# Altium schematic sheet PROB_S7CAS_PHY.SchDoc
size Tabloid; SheetNumber: 11; SheetTotal: 15; Sheet_Name: Ethernet Transceiver FPGA; Size: 11x17
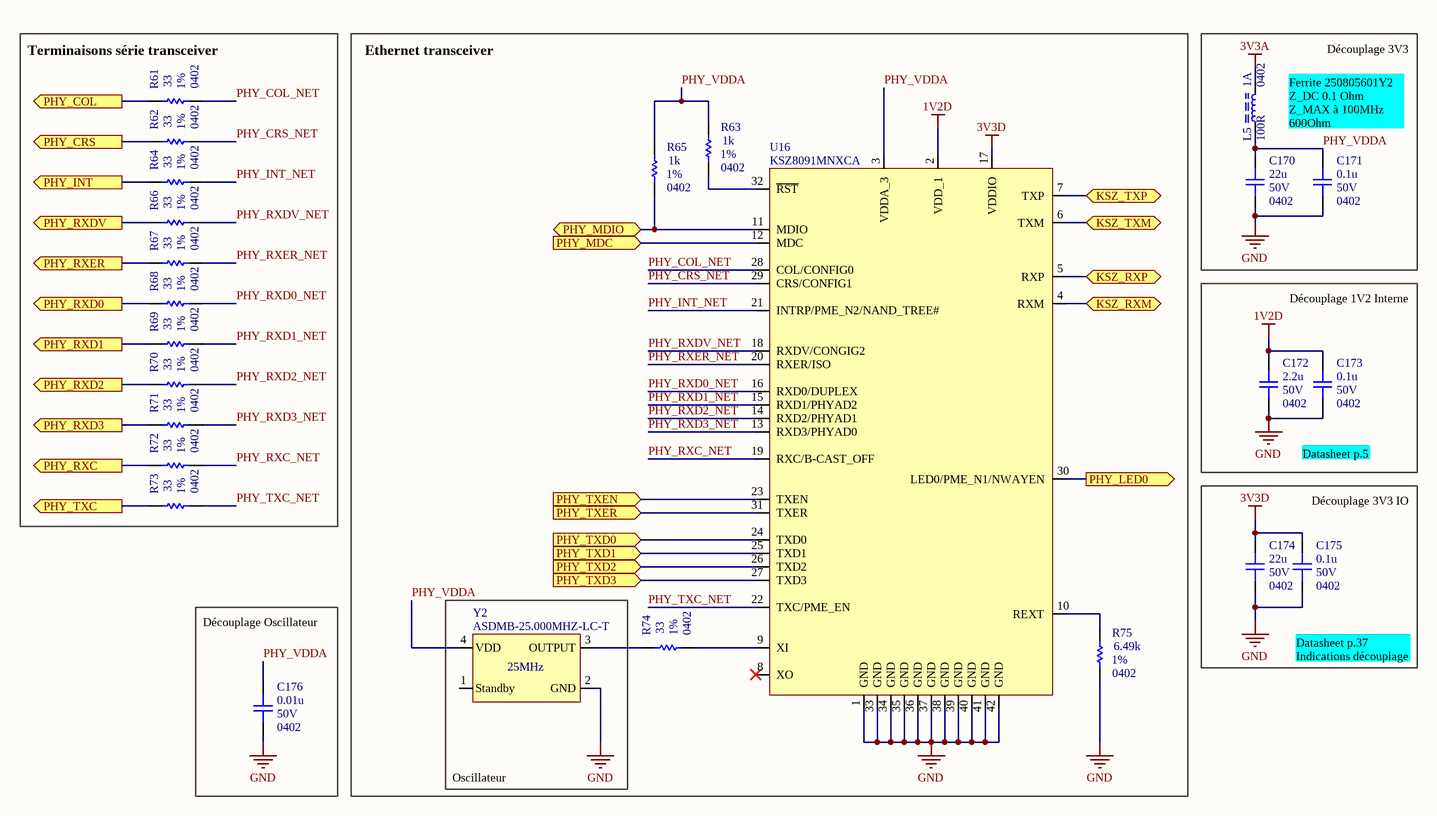
[diagram p0: PROB_S7CAS_PHY.SchDoc]

## Parts
C170  value 22u  Voltage: 50V  Package: 0402  [CAP_0402]  (hidden comment: CAP - 0402)
C171  value 0.1u  Voltage: 50V  Package: 0402  [CAP_0402]  (hidden comment: CAP - 0402)
C172  value 2.2u  Voltage: 50V  Package: 0402  [CAP_0402]  (hidden comment: CAP - 0402)
C173  value 0.1u  Voltage: 50V  Package: 0402  [CAP_0402]  (hidden comment: CAP - 0402)
C174  value 22u  Voltage: 50V  Package: 0402  [CAP_0402]  (hidden comment: CAP - 0402)
C175  value 0.1u  Voltage: 50V  Package: 0402  [CAP_0402]  (hidden comment: CAP - 0402)
C176  value 0.01u  Voltage: 50V  Package: 0402  [CAP_0402]  (hidden comment: CAP - 0402)
L5  value 100R  Current: 1A  Package: 0402  [FER_0402]  (hidden comment: FER - 0402)
R61  value 33  Package: 0402  Precision: 1%  [RES_0402]  (hidden comment: RES - 0402)
R62  value 33  Package: 0402  Precision: 1%  [RES_0402]  (hidden comment: RES - 0402)
R63  value 1k  Package: 0402  Precision: 1%  [RES_0402]  (hidden comment: RES - 0402)
R64  value 33  Package: 0402  Precision: 1%  [RES_0402]  (hidden comment: RES - 0402)
R65  value 1k  Package: 0402  Precision: 1%  [RES_0402]  (hidden comment: RES - 0402)
R66  value 33  Package: 0402  Precision: 1%  [RES_0402]  (hidden comment: RES - 0402)
R67  value 33  Package: 0402  Precision: 1%  [RES_0402]  (hidden comment: RES - 0402)
R68  value 33  Package: 0402  Precision: 1%  [RES_0402]  (hidden comment: RES - 0402)
R69  value 33  Package: 0402  Precision: 1%  [RES_0402]  (hidden comment: RES - 0402)
R70  value 33  Package: 0402  Precision: 1%  [RES_0402]  (hidden comment: RES - 0402)
R71  value 33  Package: 0402  Precision: 1%  [RES_0402]  (hidden comment: RES - 0402)
R72  value 33  Package: 0402  Precision: 1%  [RES_0402]  (hidden comment: RES - 0402)
R73  value 33  Package: 0402  Precision: 1%  [RES_0402]  (hidden comment: RES - 0402)
R74  value 33  Package: 0402  Precision: 1%  [RES_0402]  (hidden comment: RES - 0402)
R75  value 6.49k  Package: 0402  Precision: 1%  [RES_0402]  (hidden comment: RES - 0402)
U16  KSZ8091MNXCA  [COM_ETH_PHY_KSZ8091MNXCA]
Y2  ASDMB-25.000MHZ-LC-T  [OSC_ASDMB-25.000MHZ-LC-T]

## Ports
KSZ_RXM (bidir), KSZ_RXP (bidir), KSZ_TXM (bidir), KSZ_TXP (bidir), PHY_COL (out), PHY_CRS (out), PHY_INT (out), PHY_LED0 (out), PHY_MDC (in), PHY_MDIO (bidir), PHY_RXC (out), PHY_RXD0 (out), PHY_RXD1 (out), PHY_RXD2 (out), PHY_RXD3 (out), PHY_RXDV (out), PHY_RXER (out), PHY_TXC (out), PHY_TXD0 (in), PHY_TXD1 (in), PHY_TXD2 (in), PHY_TXD3 (in), PHY_TXEN (in), PHY_TXER (in)

## Nets
1V2D: C172.2 C173.2 U16.2(VDD_1)
3V3A: L5.1
3V3D: C174.2 C175.2 U16.17(VDDIO)
GND: C170.1 C171.1 C172.1 C173.1 C174.1 C175.1 C176.1 R75.1 U16.1(GND) U16.33(GND) U16.34(GND) U16.35(GND) U16.36(GND) U16.37(GND) U16.38(GND) U16.39(GND) U16.40(GND) U16.41(GND) U16.42(GND) Y2.2(GND)
KSZ_RXM: U16.4(RXM) ; port KSZ_RXM
KSZ_RXP: U16.5(RXP) ; port KSZ_RXP
KSZ_TXM: U16.6(TXM) ; port KSZ_TXM
KSZ_TXP: U16.7(TXP) ; port KSZ_TXP
PHY_COL: R61.2 ; port PHY_COL
PHY_COL_NET: R61.1 U16.28(COL/CONFIG0)
PHY_CRS: R62.2 ; port PHY_CRS
PHY_CRS_NET: R62.1 U16.29(CRS/CONFIG1)
PHY_INT: R64.2 ; port PHY_INT
PHY_INT_NET: R64.1 U16.21(INTRP/PME_N2/NAND_TREE#)
PHY_LED0: U16.30(LED0/PME_N1/NWAYEN) ; port PHY_LED0
PHY_MDC: U16.12(MDC) ; port PHY_MDC
PHY_MDIO: R65.1 U16.11(MDIO) ; port PHY_MDIO
PHY_RXC: R72.2 ; port PHY_RXC
PHY_RXC_NET: R72.1 U16.19(RXC/B-CAST_OFF)
PHY_RXD0: R68.2 ; port PHY_RXD0
PHY_RXD0_NET: R68.1 U16.16(RXD0/DUPLEX)
PHY_RXD1: R69.2 ; port PHY_RXD1
PHY_RXD1_NET: R69.1 U16.15(RXD1/PHYAD2)
PHY_RXD2: R70.2 ; port PHY_RXD2
PHY_RXD2_NET: R70.1 U16.14(RXD2/PHYAD1)
PHY_RXD3: R71.2 ; port PHY_RXD3
PHY_RXD3_NET: R71.1 U16.13(RXD3/PHYAD0)
PHY_RXDV: R66.2 ; port PHY_RXDV
PHY_RXDV_NET: R66.1 U16.18(RXDV/CONGIG2)
PHY_RXER: R67.2 ; port PHY_RXER
PHY_RXER_NET: R67.1 U16.20(RXER/ISO)
PHY_TXC: R73.2 ; port PHY_TXC
PHY_TXC_NET: R73.1 U16.22(TXC/PME_EN)
PHY_TXD0: U16.24(TXD0) ; port PHY_TXD0
PHY_TXD1: U16.25(TXD1) ; port PHY_TXD1
PHY_TXD2: U16.26(TXD2) ; port PHY_TXD2
PHY_TXD3: U16.27(TXD3) ; port PHY_TXD3
PHY_TXEN: U16.23(TXEN) ; port PHY_TXEN
PHY_TXER: U16.31(TXER) ; port PHY_TXER
PHY_VDDA: C170.2 C171.2 C176.2 L5.2 R63.2 R65.2 U16.3(VDDA_3) Y2.4(VDD)
NetR63_1: R63.1 U16.32(~{RST})
NetR74_1: R74.1 U16.9(XI)
NetR74_2: R74.2 Y2.3(OUTPUT)
NetR75_2: R75.2 U16.10(REXT)

Not connected (* = marked no-connect by the designer): U16 8(XO)*; Y2 1(Standby)

## Notes on the sheet
- (near R61) Terminaisons série transceiver
- Ethernet transceiver
- (near L5) Découplage 3V3
- Ferrite 250805601Y2 Z_DC 0.1 Ohm Z_MAX à 100MHz 600Ohm
- Découplage 1V2 Interne
- Datasheet p.5
- Découplage 3V3 IO
- Découplage Oscillateur
- Datasheet p.37 Indications découplage
- Oscillateur
- Sheet Name
- Project Title
- Global Project
- Size
- Group
- Revision
- Date
- Sheet
- of
- Filename
- Designers

## Library data of the parts
C170-C176 = CAP - 0402: Precision: 10%; Current: *; CreatedBy: Jonathan Bouchard; Power: *
R61-R75 = RES - 0402: Voltage: 50V; Power: 1/16W; Current: *; CreatedBy: Jonathan Bouchard
U16 = COM_ETH_PHY_KSZ8091MNXCA: COM - ETHERNET PHY 10/100 - QFN-32; Voltage: 1.8V, 2.5V, 3.3V; Mfg: Micrel; Current: *; Power: *; Mfg Part Number: KSZ8091MNXCA; HelpURL: http://ww1.microchip.com/downloads/en/DeviceDoc/00002275A.pdf; CreatedBy: Jonathan Bouchard; Temperature: 0°C ~ 70°C; Value: *; Precision: *; Package: QFN-32; Supplier 1: Digikey; Supplier Part Number 1: 576-4356-ND
Y2 = OSC_ASDMB-25.000MHZ-LC-T: OSC - 25MHz XO (Standard) LVCMOS - 4-SMD, No Lead; Manufacturer #1: Abracon LLC; Tolerance: ±50ppm; Voltage Rating: 1.8V ~ 3.3V; GRAMS Lib Spec: 2.8; Magnetic Material: Unknown; Polarized: Yes; Value: 25MHz; Current Rating: *; Power Max: *; HelpURL: https://abracon.com/Oscillators/ASDMB.pdf; CreatedBy/Date: Joël Lemay 2019-03-29; VerifiedBy: C. Paulin - 29 mai 2019; Temperature: -40°C ~ +85°C; Package: 4-SMD, No Lead; Manufacturer #2: *; Note: *; Assembly Type: SMD; Part Number #2: *; Part Number #1: ASDMB-25.000MHZ-LC-T; Supplier 1: Digi-Key; Supplier Part Number 1: 535-11730-1-ND; Cryo: UNKNOWN
L5 = FER - 0402: Voltage: *; CreatedBy: Jonathan Bouchard; Power: *; Precision: *